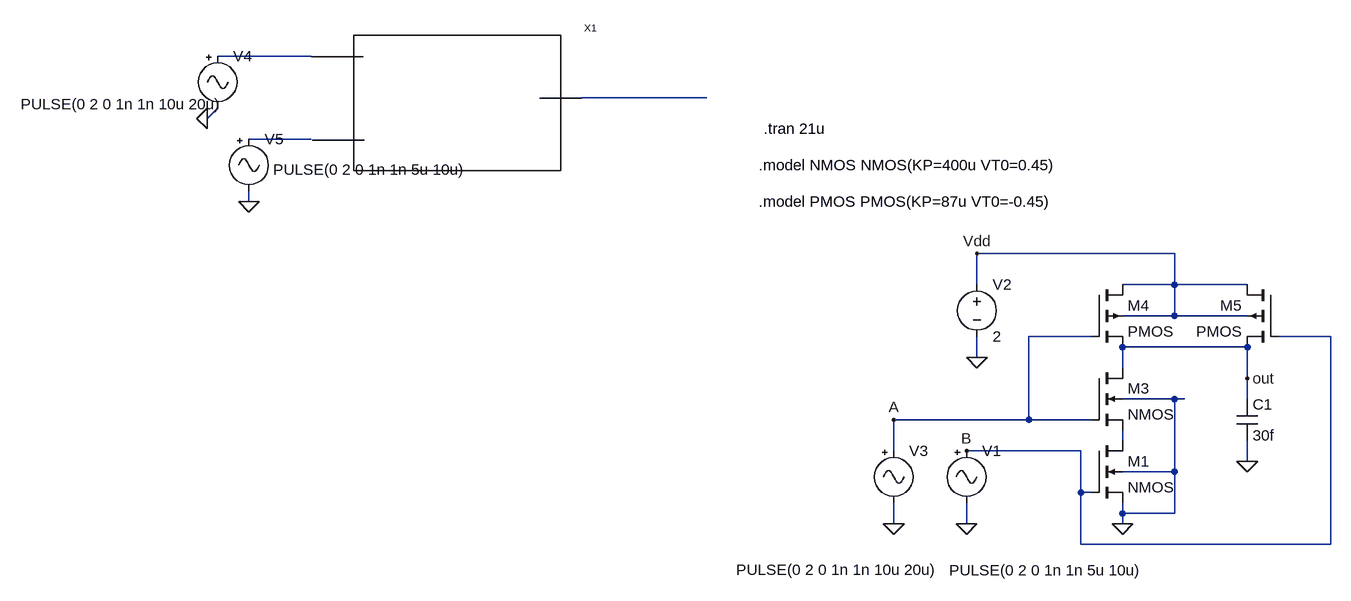
[diagram p0: schematic NAND2.asc]
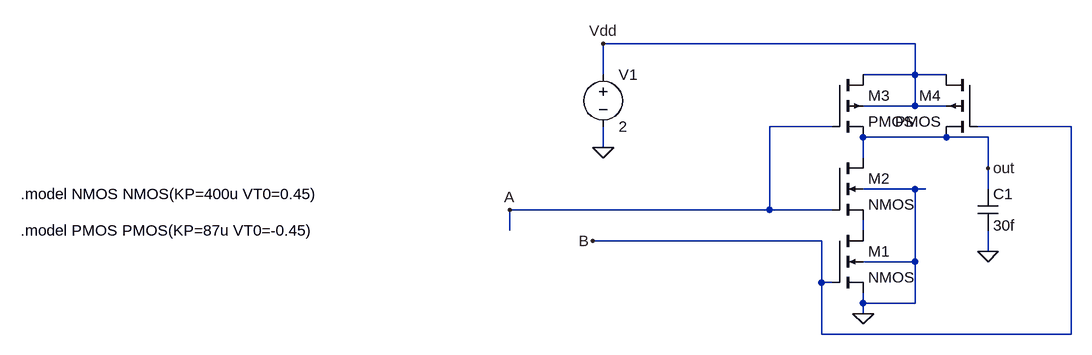
[diagram p1: sub-circuit nand2_symbol.asc]
NAND2.asc, the LTspice schematic file:
Version 4
SHEET 1 880 680
WIRE -720 -896 -864 -896
WIRE -112 -832 -304 -832
WIRE -880 -800 -864 -816
WIRE -720 -768 -816 -768
WIRE -816 -672 -816 -688
WIRE 608 -592 304 -592
WIRE 304 -544 304 -592
WIRE 608 -544 608 -592
WIRE 608 -544 528 -544
WIRE 720 -544 608 -544
WIRE 608 -496 608 -544
WIRE 608 -496 528 -496
WIRE 720 -496 608 -496
WIRE 480 -464 384 -464
WIRE 848 -464 768 -464
WIRE 720 -448 528 -448
WIRE 304 -432 304 -464
WIRE 528 -416 528 -448
WIRE 720 -400 720 -448
WIRE 608 -368 528 -368
WIRE 624 -368 608 -368
WIRE 720 -368 720 -400
WIRE 384 -336 384 -464
WIRE 384 -336 176 -336
WIRE 480 -336 384 -336
WIRE 528 -304 528 -320
WIRE 176 -288 176 -336
WIRE 464 -288 288 -288
WIRE 720 -272 720 -304
WIRE 608 -256 608 -368
WIRE 608 -256 528 -256
WIRE 464 -224 464 -288
WIRE 480 -224 464 -224
WIRE 528 -192 528 -208
WIRE 608 -192 608 -256
WIRE 608 -192 528 -192
WIRE 176 -176 176 -208
WIRE 288 -176 288 -208
WIRE 528 -176 528 -192
WIRE 464 -144 464 -224
WIRE 848 -144 848 -464
WIRE 848 -144 464 -144
FLAG 176 -176 0
FLAG 304 -432 0
FLAG 720 -272 0
FLAG 288 -176 0
FLAG 528 -176 0
FLAG 720 -400 out
FLAG 176 -336 A
FLAG 288 -288 B
FLAG 304 -592 Vdd
FLAG -816 -672 0
FLAG -880 -800 0
SYMBOL nmos4 480 -304 R0
SYMATTR InstName M1
SYMATTR Value2 l=0.15u w=1.24u
SYMBOL voltage 304 -560 R0
WINDOW 123 0 0 Left 0
WINDOW 39 0 0 Left 0
SYMATTR InstName V2
SYMATTR Value 2
SYMBOL cap 704 -368 R0
SYMATTR InstName C1
SYMATTR Value 30f
SYMBOL nmos4 480 -416 R0
SYMATTR InstName M3
SYMATTR Value2 l=0.15u w=1.24u
SYMBOL pmos4 480 -544 R0
SYMATTR InstName M4
SYMATTR Value2 l=0.15u w=2.85u
SYMBOL pmos4 768 -544 M0
SYMATTR InstName M5
SYMATTR Value2 l=0.15u w=2.85u
SYMBOL Misc\\signal 288 -304 R0
WINDOW 3 -27 200 Left 2
WINDOW 123 0 0 Left 0
WINDOW 39 0 0 Left 0
SYMATTR Value PULSE(0 2 0 1n 1n 5u 10u)
SYMATTR InstName V1
SYMBOL Misc\\signal 176 -304 R0
WINDOW 3 -242 199 Left 2
WINDOW 123 0 0 Left 0
WINDOW 39 0 0 Left 0
SYMATTR Value PULSE(0 2 0 1n 1n 10u 20u)
SYMATTR InstName V3
SYMBOL NAND2_symbol -480 -800 R0
SYMATTR InstName X1
SYMBOL Misc\\signal -864 -912 R0
WINDOW 3 -303 90 Left 2
WINDOW 123 0 0 Left 0
WINDOW 39 0 0 Left 0
SYMATTR Value PULSE(0 2 0 1n 1n 10u 20u)
SYMATTR InstName V4
SYMBOL Misc\\signal -816 -784 R0
WINDOW 3 37 63 Left 2
WINDOW 123 0 0 Left 0
WINDOW 39 0 0 Left 0
SYMATTR Value PULSE(0 2 0 1n 1n 5u 10u)
SYMATTR InstName V5
TEXT -32 -728 Left 2 !.model NMOS NMOS(KP=400u VT0=0.45)
TEXT -32 -672 Left 2 !.model PMOS PMOS(KP=87u VT0=-0.45)
TEXT -24 -784 Left 2 !.tran 21u

nand2_symbol.asc, the sub-circuit schematic file:
Version 4
SHEET 1 1156 680
WIRE 912 32 432 32
WIRE 432 80 432 32
WIRE 912 80 912 32
WIRE 912 80 832 80
WIRE 960 80 912 80
WIRE 912 128 912 80
WIRE 912 128 832 128
WIRE 960 128 912 128
WIRE 784 160 688 160
WIRE 1152 160 1008 160
WIRE 960 176 832 176
WIRE 1024 176 960 176
WIRE 432 192 432 160
WIRE 832 208 832 176
WIRE 1024 224 1024 176
WIRE 912 256 832 256
WIRE 928 256 912 256
WIRE 1024 256 1024 224
WIRE 688 288 688 160
WIRE 688 288 288 288
WIRE 784 288 688 288
WIRE 288 320 288 288
WIRE 832 320 832 304
WIRE 768 336 416 336
WIRE 1024 352 1024 320
WIRE 912 368 912 256
WIRE 912 368 832 368
WIRE 768 400 768 336
WIRE 784 400 768 400
WIRE 832 432 832 416
WIRE 912 432 912 368
WIRE 912 432 832 432
WIRE 832 448 832 432
WIRE 768 480 768 400
WIRE 1152 480 1152 160
WIRE 1152 480 768 480
FLAG 432 192 0
FLAG 1024 352 0
FLAG 832 448 0
FLAG 1024 224 out
FLAG 288 288 A
FLAG 416 336 B
FLAG 432 32 Vdd
SYMBOL nmos4 784 320 R0
SYMATTR InstName M1
SYMATTR Value2 l=0.15u w=1.24u
SYMBOL voltage 432 64 R0
WINDOW 123 0 0 Left 0
WINDOW 39 0 0 Left 0
SYMATTR InstName V1
SYMATTR Value 2
SYMBOL cap 1008 256 R0
SYMATTR InstName C1
SYMATTR Value 30f
SYMBOL nmos4 784 208 R0
SYMATTR InstName M2
SYMATTR Value2 l=0.15u w=1.24u
SYMBOL pmos4 784 80 R0
SYMATTR InstName M3
SYMATTR Value2 l=0.15u w=2.85u
SYMBOL pmos4 1008 80 M0
SYMATTR InstName M4
SYMATTR Value2 l=0.15u w=2.85u
TEXT -464 264 Left 2 !.model NMOS NMOS(KP=400u VT0=0.45)
TEXT -464 320 Left 2 !.model PMOS PMOS(KP=87u VT0=-0.45)

The netlist it stands for:
* NAND2.asc
M1 N004 B 0 0 NMOS l=0.15u w=1.24u
V2 Vdd 0 2
C1 out 0 30f
M3 out A N004 0 NMOS l=0.15u w=1.24u
M4 Vdd A out Vdd PMOS l=0.15u w=2.85u
M5 Vdd B out Vdd PMOS l=0.15u w=2.85u
V1 B 0 PULSE(0 2 0 1n 1n 5u 10u)
V3 A 0 PULSE(0 2 0 1n 1n 10u 20u)
XX1 N001 N003 N002 nand2_symbol
V4 N001 0 PULSE(0 2 0 1n 1n 10u 20u)
V5 N003 0 PULSE(0 2 0 1n 1n 5u 10u)

* block symbol definitions
.subckt nand2_symbol A B out
M1 N001 B 0 0 NMOS l=0.15u w=1.24u
V1 Vdd 0 2
C1 out 0 30f
M2 out A N001 0 NMOS l=0.15u w=1.24u
M3 Vdd A out Vdd PMOS l=0.15u w=2.85u
M4 Vdd B out Vdd PMOS l=0.15u w=2.85u
.model NMOS NMOS(KP=400u VT0=0.45)
.model PMOS PMOS(KP=87u VT0=-0.45)
.ends nand2_symbol

.model NMOS NMOS
.model PMOS PMOS
.lib standard.mos
.model NMOS NMOS(KP=400u VT0=0.45)
.model PMOS PMOS(KP=87u VT0=-0.45)
.tran 21u
.backanno
.end